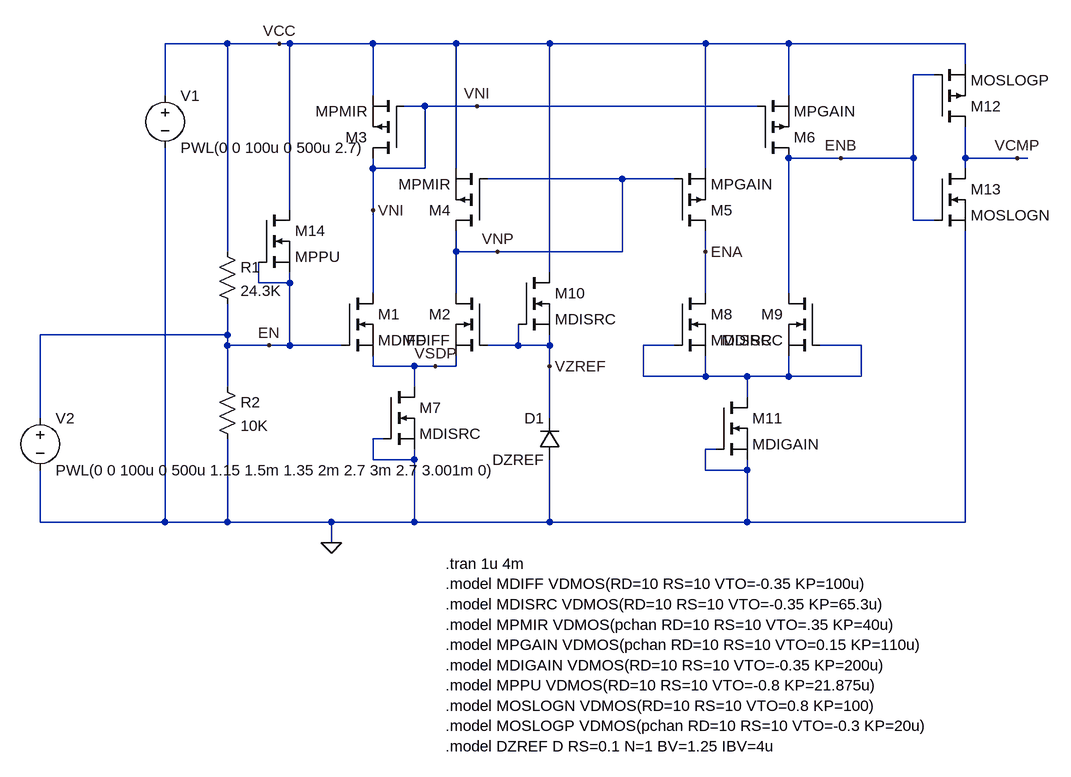
[diagram p0: schematic Draft1.asc]
Draft1.asc, the LTspice schematic file:
Version 4
SHEET 1 1276 740
WIRE 16 -272 -80 -272
WIRE 96 -272 16 -272
WIRE 112 -272 96 -272
WIRE 240 -272 112 -272
WIRE 368 -272 240 -272
WIRE 512 -272 368 -272
WIRE 752 -272 512 -272
WIRE 880 -272 752 -272
WIRE 1152 -272 880 -272
WIRE 1152 -240 1152 -272
WIRE 1104 -224 1072 -224
WIRE -80 -192 -80 -272
WIRE 240 -192 240 -272
WIRE 880 -192 880 -272
WIRE 320 -176 288 -176
WIRE 400 -176 320 -176
WIRE 832 -176 400 -176
WIRE 960 -96 880 -96
WIRE 1072 -96 1072 -224
WIRE 1072 -96 960 -96
WIRE 1152 -96 1152 -144
WIRE 1232 -96 1152 -96
WIRE 1248 -96 1232 -96
WIRE 240 -80 240 -96
WIRE 320 -80 320 -176
WIRE 320 -80 240 -80
WIRE 368 -80 368 -272
WIRE 752 -80 752 -272
WIRE 1152 -80 1152 -96
WIRE 624 -64 416 -64
WIRE 704 -64 624 -64
WIRE 112 -16 112 -272
WIRE 240 -16 240 -80
WIRE 1072 0 1072 -96
WIRE 1104 0 1072 0
WIRE 16 48 16 -272
WIRE 368 48 368 16
WIRE 432 48 368 48
WIRE 624 48 624 -64
WIRE 624 48 432 48
WIRE 752 48 752 16
WIRE 512 80 512 -272
WIRE 64 96 64 64
WIRE 112 96 112 80
WIRE 112 96 64 96
WIRE 240 112 240 -16
WIRE 368 112 368 48
WIRE 752 112 752 48
WIRE 880 112 880 -96
WIRE 16 176 16 128
WIRE 16 176 -272 176
WIRE 16 192 16 176
WIRE 80 192 16 192
WIRE 112 192 112 96
WIRE 112 192 80 192
WIRE 192 192 112 192
WIRE 464 192 464 160
WIRE 464 192 416 192
WIRE 512 192 512 176
WIRE 512 192 464 192
WIRE 704 192 656 192
WIRE 992 192 928 192
WIRE 240 224 240 208
WIRE 304 224 240 224
WIRE 336 224 304 224
WIRE 368 224 368 208
WIRE 368 224 336 224
WIRE 512 224 512 192
WIRE 656 240 656 192
WIRE 752 240 752 208
WIRE 752 240 656 240
WIRE 816 240 752 240
WIRE 880 240 880 208
WIRE 880 240 816 240
WIRE 992 240 992 192
WIRE 992 240 880 240
WIRE 16 256 16 192
WIRE 304 256 304 224
WIRE 816 272 816 240
WIRE -272 304 -272 176
WIRE 512 304 512 224
WIRE 256 336 240 336
WIRE 768 352 752 352
WIRE 240 368 240 336
WIRE 304 368 304 352
WIRE 304 368 240 368
WIRE 752 384 752 352
WIRE 816 384 816 368
WIRE 816 384 752 384
WIRE -272 464 -272 384
WIRE -80 464 -80 -112
WIRE -80 464 -272 464
WIRE 16 464 16 336
WIRE 16 464 -80 464
WIRE 176 464 16 464
WIRE 304 464 304 368
WIRE 304 464 176 464
WIRE 512 464 512 368
WIRE 512 464 304 464
WIRE 816 464 816 384
WIRE 816 464 512 464
WIRE 1152 464 1152 16
WIRE 1152 464 816 464
WIRE 176 496 176 464
FLAG 80 192 EN
FLAG 96 -272 VCC
FLAG 960 -96 ENB
FLAG 336 224 VSDP
FLAG 240 -16 VNI
FLAG 432 48 VNP
FLAG 400 -176 VNI
FLAG 176 496 0
FLAG 512 224 VZREF
FLAG 752 48 ENA
FLAG 1232 -96 VCMP
SYMBOL nmos 192 112 R0
SYMATTR InstName M1
SYMATTR Value MDIFF
SYMBOL nmos 416 112 M0
SYMATTR InstName M2
SYMATTR Value MDIFF
SYMBOL diode 528 368 R180
WINDOW 0 24 64 Left 2
WINDOW 3 24 0 Left 2
SYMATTR InstName D1
SYMATTR Value DZREF
SYMBOL pmos 288 -96 R180
SYMATTR InstName M3
SYMATTR Value MPMIR
SYMBOL pmos 416 16 R180
SYMATTR InstName M4
SYMATTR Value MPMIR
SYMBOL pmos 704 16 M180
SYMATTR InstName M5
SYMATTR Value MPGAIN
SYMBOL pmos 832 -96 M180
SYMATTR InstName M6
SYMATTR Value MPGAIN
SYMBOL nmos 256 256 R0
SYMATTR InstName M7
SYMATTR Value MDISRC
SYMBOL nmos 704 112 R0
SYMATTR InstName M8
SYMATTR Value MDISRC
SYMBOL nmos 928 112 M0
SYMATTR InstName M9
SYMATTR Value MDISRC
SYMBOL voltage -80 -208 R0
SYMATTR InstName V1
SYMATTR Value PWL(0 0 100u 0 500u 2.7)
SYMBOL nmos 464 80 R0
SYMATTR InstName M10
SYMATTR Value MDISRC
SYMBOL res 0 32 R0
SYMATTR InstName R1
SYMATTR Value 24.3K
SYMBOL res 0 240 R0
SYMATTR InstName R2
SYMATTR Value 10K
SYMBOL nmos 768 272 R0
SYMATTR InstName M11
SYMATTR Value MDIGAIN
SYMBOL voltage -272 288 R0
SYMATTR InstName V2
SYMATTR Value PWL(0 0 100u 0 500u 1.15 1.5m 1.35 2m 2.7 3m 2.7 3.001m 0)
SYMBOL pmos 1104 -144 M180
SYMATTR InstName M12
SYMATTR Value MOSLOGP
SYMBOL nmos 1104 -80 R0
SYMATTR InstName M13
SYMATTR Value MOSLOGN
SYMBOL nmos 64 -16 R0
SYMATTR InstName M14
SYMATTR Value MPPU
TEXT 352 528 Left 2 !.tran 1u 4m\n.model MDIFF VDMOS(RD=10 RS=10 VTO=-0.35 KP=100u)\n.model MDISRC VDMOS(RD=10 RS=10 VTO=-0.35 KP=65.3u)\n.model MPMIR VDMOS(pchan RD=10 RS=10 VTO=.35 KP=40u)\n.model MPGAIN VDMOS(pchan RD=10 RS=10 VTO=0.15 KP=110u)\n.model MDIGAIN VDMOS(RD=10 RS=10 VTO=-0.35 KP=200u)\n.model MPPU VDMOS(RD=10 RS=10 VTO=-0.8 KP=21.875u)\n.model MOSLOGN VDMOS(RD=10 RS=10 VTO=0.8 KP=100)\n.model MOSLOGP VDMOS(pchan RD=10 RS=10 VTO=-0.3 KP=20u)\n.model DZREF D RS=0.1 N=1 BV=1.25 IBV=4u

The netlist it stands for:
* Draft1.asc
M1 VNI EN VSDP VSDP MDIFF
M2 VNP VZREF VSDP VSDP MDIFF
D1 0 VZREF DZREF
M3 VNI VNI VCC VCC MPMIR
M4 VNP VNP VCC VCC MPMIR
M5 ENA VNP VCC VCC MPGAIN
M6 ENB VNI VCC VCC MPGAIN
M7 VSDP 0 0 0 MDISRC
M8 ENA N001 N001 N001 MDISRC
M9 ENB N001 N001 N001 MDISRC
V1 VCC 0 PWL(0 0 100u 0 500u 2.7)
M10 VCC VZREF VZREF VZREF MDISRC
R1 VCC EN 24.3K
R2 EN 0 10K
M11 N001 0 0 0 MDIGAIN
V2 EN 0 PWL(0 0 100u 0 500u 1.15 1.5m 1.35 2m 2.7 3m 2.7 3.001m 0)
M12 VCMP ENB VCC VCC MOSLOGP
M13 VCMP ENB 0 0 MOSLOGN
M14 VCC EN EN EN MPPU
.model D D
.lib standard.dio
.model NMOS NMOS
.model PMOS PMOS
.lib standard.mos
.tran 1u 4m
.model MDIFF VDMOS(RD=10 RS=10 VTO=-0.35 KP=100u)
.model MDISRC VDMOS(RD=10 RS=10 VTO=-0.35 KP=65.3u)
.model MPMIR VDMOS(pchan RD=10 RS=10 VTO=.35 KP=40u)
.model MPGAIN VDMOS(pchan RD=10 RS=10 VTO=0.15 KP=110u)
.model MDIGAIN VDMOS(RD=10 RS=10 VTO=-0.35 KP=200u)
.model MPPU VDMOS(RD=10 RS=10 VTO=-0.8 KP=21.875u)
.model MOSLOGN VDMOS(RD=10 RS=10 VTO=0.8 KP=100)
.model MOSLOGP VDMOS(pchan RD=10 RS=10 VTO=-0.3 KP=20u)
.model DZREF D RS=0.1 N=1 BV=1.25 IBV=4u
.backanno
.end